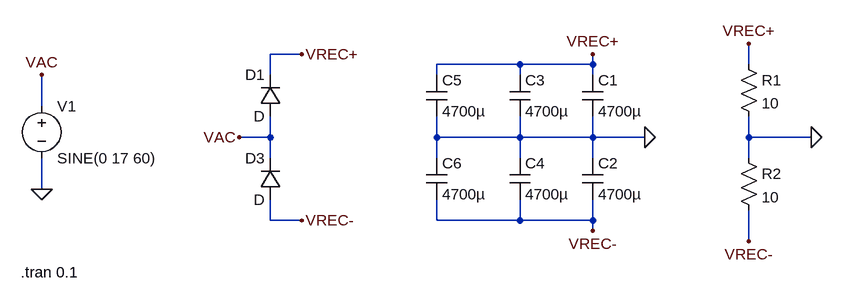
[diagram p0: schematic supply.asc]
supply.asc, the LTspice schematic file:
Version 4
SHEET 1 1396 680
WIRE 192 80 144 80
WIRE 528 96 400 96
WIRE 640 96 640 80
WIRE 640 96 528 96
WIRE 880 96 880 64
WIRE 144 112 144 80
WIRE 400 112 400 96
WIRE 528 112 528 96
WIRE 640 112 640 96
WIRE -208 160 -208 112
WIRE 144 208 144 176
WIRE 144 208 96 208
WIRE 400 208 400 176
WIRE 528 208 528 176
WIRE 528 208 400 208
WIRE 640 208 640 176
WIRE 640 208 528 208
WIRE 720 208 640 208
WIRE 880 208 880 176
WIRE 976 208 880 208
WIRE 144 240 144 208
WIRE 400 240 400 208
WIRE 528 240 528 208
WIRE 640 240 640 208
WIRE 880 240 880 208
WIRE -208 288 -208 240
WIRE 144 336 144 304
WIRE 192 336 144 336
WIRE 400 336 400 304
WIRE 528 336 528 304
WIRE 528 336 400 336
WIRE 640 336 640 304
WIRE 640 336 528 336
WIRE 640 352 640 336
WIRE 880 368 880 320
FLAG 96 208 VAC
FLAG 192 80 VREC+
FLAG 192 336 VREC-
FLAG -208 112 VAC
FLAG 640 80 VREC+
FLAG 640 352 VREC-
FLAG 720 208 0
FLAG 880 64 VREC+
FLAG 880 368 VREC-
FLAG 976 208 0
FLAG -208 288 0
SYMBOL diode 160 176 R180
WINDOW 0 24 64 Left 2
WINDOW 3 24 0 Left 2
SYMATTR InstName D1
SYMBOL diode 160 304 R180
WINDOW 0 24 64 Left 2
WINDOW 3 24 0 Left 2
SYMATTR InstName D3
SYMBOL voltage -208 144 R0
WINDOW 123 0 0 Left 0
WINDOW 39 0 0 Left 0
SYMATTR InstName V1
SYMATTR Value SINE(0 17 60)
SYMBOL cap 624 112 R0
SYMATTR InstName C1
SYMATTR Value 4700µ
SYMBOL cap 624 240 R0
SYMATTR InstName C2
SYMATTR Value 4700µ
SYMBOL res 864 80 R0
SYMATTR InstName R1
SYMATTR Value 10
SYMBOL res 864 224 R0
SYMATTR InstName R2
SYMATTR Value 10
SYMBOL cap 512 112 R0
SYMATTR InstName C3
SYMATTR Value 4700µ
SYMBOL cap 512 240 R0
SYMATTR InstName C4
SYMATTR Value 4700µ
SYMBOL cap 384 112 R0
SYMATTR InstName C5
SYMATTR Value 4700µ
SYMBOL cap 384 240 R0
SYMATTR InstName C6
SYMATTR Value 4700µ
TEXT -240 416 Left 2 !.tran 0.1

The netlist it stands for:
* supply.asc
D1 VAC VREC+ D
D3 VREC- VAC D
V1 VAC 0 SINE(0 17 60)
C1 VREC+ 0 4700µ
C2 0 VREC- 4700µ
R1 VREC+ 0 10
R2 0 VREC- 10
C3 VREC+ 0 4700µ
C4 0 VREC- 4700µ
C5 VREC+ 0 4700µ
C6 0 VREC- 4700µ
.model D D
.lib standard.dio
.tran 0.1
.backanno
.end